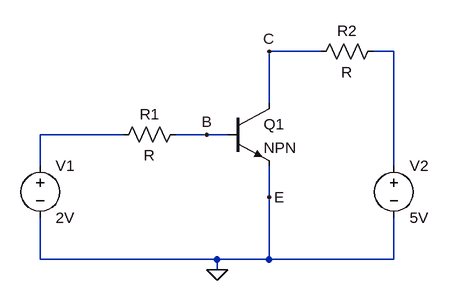
[diagram p0: schematic Draft30.asc]
Draft30.asc, the LTspice schematic file:
Version 4
SHEET 1 880 680
WIRE 384 -16 304 -16
WIRE 496 -16 464 -16
WIRE 304 64 304 -16
WIRE 80 112 -48 112
WIRE 208 112 160 112
WIRE 240 112 208 112
WIRE -48 160 -48 112
WIRE 496 160 496 -16
WIRE 304 208 304 160
WIRE -48 304 -48 240
WIRE 224 304 -48 304
WIRE 304 304 304 208
WIRE 304 304 224 304
WIRE 496 304 496 240
WIRE 496 304 304 304
WIRE 224 320 224 304
FLAG 224 320 0
FLAG 208 112 B
FLAG 304 -16 C
FLAG 304 208 E
SYMBOL voltage -48 144 R0
SYMATTR InstName V1
SYMATTR Value 2V
SYMBOL voltage 496 144 R0
WINDOW 123 0 0 Left 0
WINDOW 39 0 0 Left 0
SYMATTR InstName V2
SYMATTR Value 5V
SYMBOL npn 240 64 R0
SYMATTR InstName Q1
SYMBOL res 176 96 R90
WINDOW 0 0 56 VBottom 2
WINDOW 3 32 56 VTop 2
SYMATTR InstName R1
SYMBOL res 480 -32 R90
WINDOW 0 0 56 VBottom 2
WINDOW 3 32 56 VTop 2
SYMATTR InstName R2

The netlist it stands for:
* Draft30.asc
V1 N002 0 2V
V2 N001 0 5V
Q1 C B 0 0 NPN
R1 B N002 R
R2 N001 C R
.model NPN NPN
.model PNP PNP
.lib standard.bjt
.backanno
.end